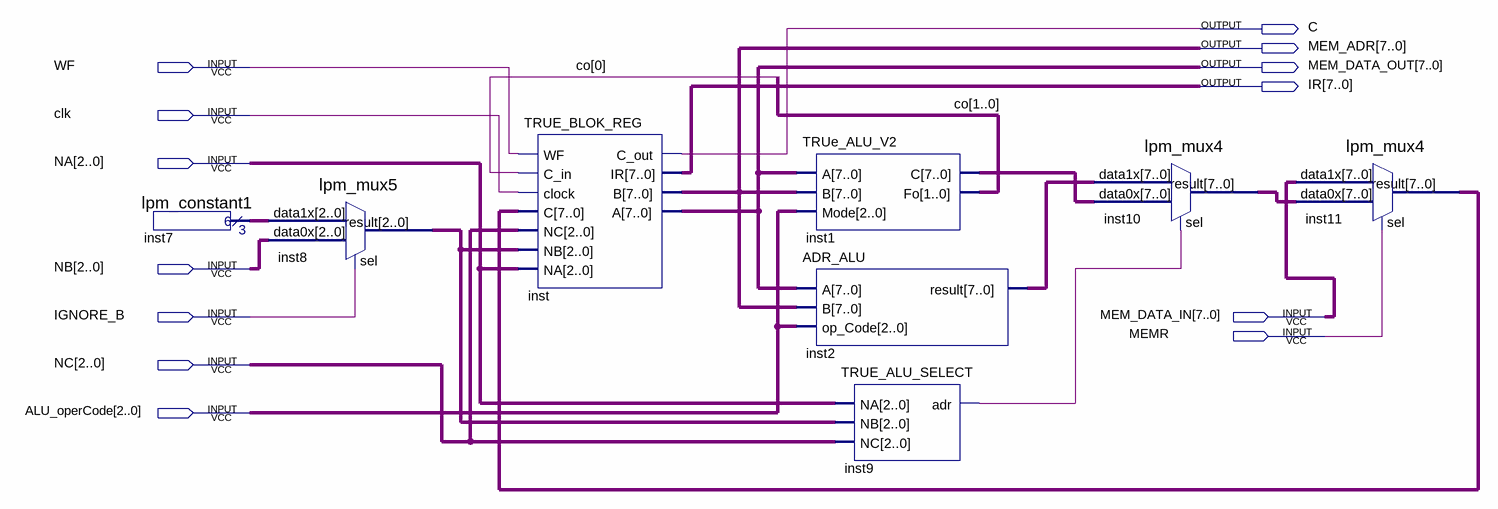
[diagram p0: schematic sheet]
// Quartus schematic TRUE_OU.bdf as structural Verilog: 8 symbols, 13 pins
module TRUE_OU (
  input  WF,
  input  clk,
  input  [2:0] NA,
  input  [2:0] NB,
  input  IGNORE_B,
  input  [7:0] MEM_DATA_IN,
  input  MEMR,
  input  [2:0] NC,
  input  [2:0] ALU_operCode,
  output C,
  output [7:0] MEM_ADR,
  output [7:0] MEM_DATA_OUT,
  output [7:0] IR
);

  wire inst9_adr;
  wire [1:0] co;
  wire [2:0] inst7_result, inst8_result;
  wire [7:0] inst1_c, inst2_result, inst10_result, inst11_result;

  lpm_constant1 inst7 (.result(inst7_result));
  lpm_mux5 inst8 (.data1x(inst7_result), .data0x(NB), .sel(IGNORE_B), .result(inst8_result));
  TRUE_BLOK_REG inst (
    .WF(WF), .C_in(co[0]), .clock(clk), .C(inst11_result), .NC(NC), .NB(inst8_result), .NA(NA), .C_out(C),
    .IR(IR), .B(MEM_ADR), .A(MEM_DATA_OUT));
  TRUe_ALU_V2 inst1 (.A(MEM_DATA_OUT), .B(MEM_ADR), .Mode(ALU_operCode), .C(inst1_c), .Fo(co));
  ADR_ALU inst2 (.A(MEM_DATA_OUT), .B(MEM_ADR), .op_Code(ALU_operCode), .result(inst2_result));
  TRUE_ALU_SELECT inst9 (.NA(NA), .NB(inst8_result), .NC(NC), .adr(inst9_adr));
  lpm_mux4 inst10 (.data1x(inst2_result), .data0x(inst1_c), .sel(inst9_adr), .result(inst10_result));
  lpm_mux4 inst11 (.data1x(MEM_DATA_IN), .data0x(inst10_result), .sel(MEMR), .result(inst11_result));
endmodule
